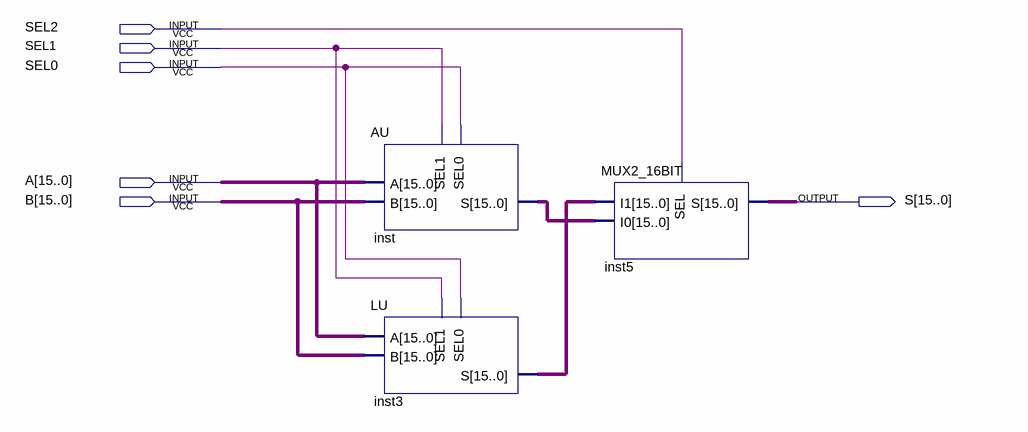
[diagram p0: schematic sheet]
// Quartus schematic ALU.bdf as structural Verilog: 3 symbols, 6 pins
module ALU (
  input  SEL2,
  input  SEL1,
  input  SEL0,
  input  [15:0] A,
  input  [15:0] B,
  output [15:0] S
);

  wire [15:0] inst3_s, inst_s;

  AU inst (.A(A), .B(B), .SEL1(SEL1), .SEL0(SEL0), .S(inst_s));
  LU inst3 (.A(A), .B(B), .SEL1(SEL1), .SEL0(SEL0), .S(inst3_s));
  MUX2_16BIT inst5 (.I1(inst3_s), .I0(inst_s), .SEL(SEL2), .S(S));
endmodule
